# Altium schematic sheet RMS_to_DC.SchDoc
size A4; DrawnBy: 阳光电路; Organization: 阳光电路; Address1: 中国; Address2: 桂林; Address3: 阳朔; Address4: 中国 2021
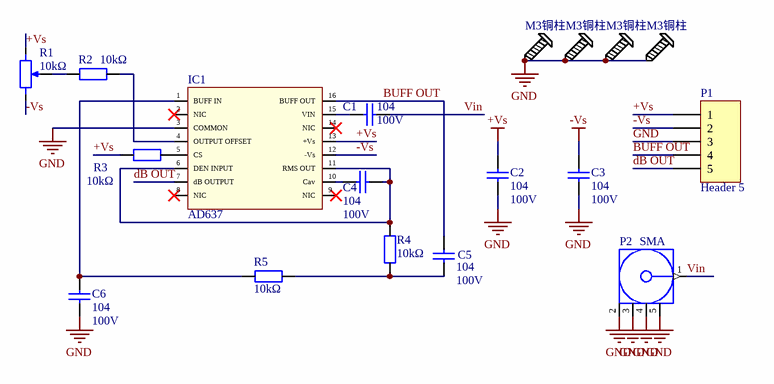
[diagram p0: RMS_to_DC.SchDoc]

## Parts
C1  voltage: 100V  [C0603]  (hidden comment: 叠层陶瓷电容)
C2  voltage: 100V  [C0603]  (hidden comment: 叠层陶瓷电容)
C3  voltage: 100V  [C0603]  (hidden comment: 叠层陶瓷电容)
C4  voltage: 100V  [C0603]  (hidden comment: 叠层陶瓷电容)
C5  voltage: 100V  [C0603]  (hidden comment: 叠层陶瓷电容)
C6  voltage: 100V  [C0603]  (hidden comment: 叠层陶瓷电容)
IC1  AD637  [SOP-16(体宽7.5mm)]
P1  Header 5  [HDR1X5]
P2  SMA  [SMA-夹板]
R1  10kΩ  [3296W-103]
R2  贴片电阻  [R0603]  (value not drawn)
R3  贴片电阻  [R0603]  (value not drawn)
R4  贴片电阻  [R0603]  (value not drawn)
R5  贴片电阻  [R0603]  (value not drawn)
S1  M3铜柱  [M3]
S2  M3铜柱  [M3]
S3  M3铜柱  [M3]
S4  M3铜柱  [M3]

## Nets
+Vs: C2.2 IC1.13(+Vs) P1.1 R1.3 R3.1
-Vs: C3.2 IC1.12(-Vs) P1.2 R1.1
GND: C2.1 C3.1 C6.1 IC1.3(COMMON) P1.3 P2.2 P2.3 P2.4 P2.5 S1.1(GND) S2.1(GND) S3.1(GND) S4.1(GND)
BUFF OUT: C5.2 IC1.16(BUFF_OUT) P1.4
dB OUT: IC1.7(dB_OUTPUT) P1.5
Vin: C1.2 P2.1
NetC1_1: C1.1 IC1.15(VIN)
NetC4_1: C4.1 IC1.10(Cav)
NetC4_2: C4.2 IC1.6(DEN_INPUT) IC1.11(RMS_OUT) R4.2
NetC5_1: C5.1 R4.1 R5.2
NetC6_2: C6.2 IC1.1(BUFF_IN) R5.1
NetIC1_4: IC1.4(OUTPUT_OFFSET) R2.2
NetIC1_5: IC1.5(CS) R3.2
NetR1_2: R1.2 R2.1

Not connected (* = marked no-connect by the designer): IC1 2(NIC)* 8(NIC)* 9(NIC)* 14(NIC)*

## Notes on the sheet
- Title
- DrawnBy:
- Size:
- Date:
- A4
- Number:
- Time:
- Revision:
- Sheet
- of
- File:

## Library data of the parts
C1-C6 = 104: 无极性电容; type: 0805; capacity: 104
IC1 = AD637: RMS TO DC均方根转换芯片
P1 = Header 5: Header, 5-Pin; LatestRevisionDate: 17-Jul-2002; LatestRevisionNote: Re-released for DXP Platform.; Publisher: Altium Limited
P2 = SMA: 射频座
R1 = 100kΩ: 三脚可调式电位器
R2-R5 = 10kΩ: 贴片/直插电阻; package: 0805; resistance: 10kΩ